# Altium schematic sheet adc.SchDoc: ADC_PCM1802_SCH
size A3; Author: Hojnadel - Salazar Ato; Revision: Rev1.0; SheetNumber: 5; SheetTotal: 6
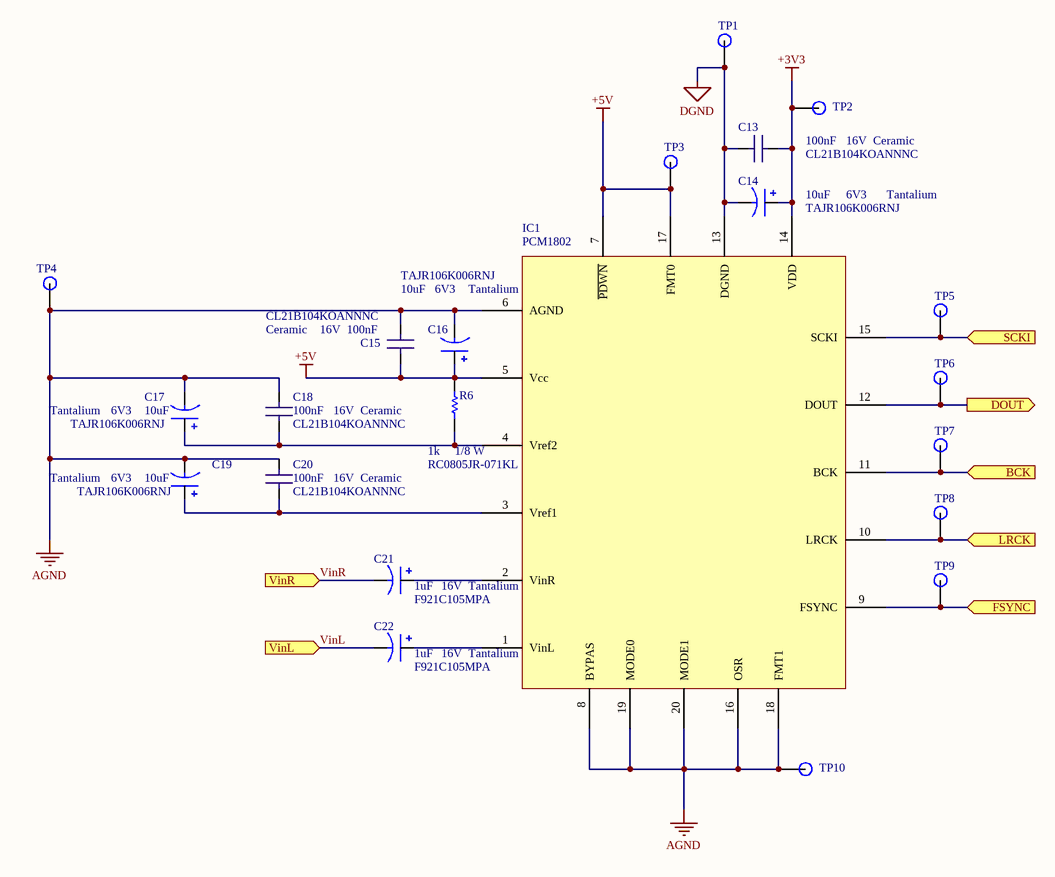
[diagram p0: adc.SchDoc]

## Parts
C13  C: 100nF  V: 16V  Part Number: CL21B104KOANNNC  Material: Ceramic  [C_0805]  (hidden comment: 100nF 16V Ceramic)
C14  C: 10uF  V: 6V3  Material: Tantalium  Part number: TAJR106K006RNJ  [C_0805_pol]  (hidden comment: 10uF 6V3 Tantalium)
C15  C: 100nF  V: 16V  Part Number: CL21B104KOANNNC  Material: Ceramic  [C_0805]  (hidden comment: 100nF 16V Ceramic)
C16  C: 10uF  V: 6V3  Material: Tantalium  Part number: TAJR106K006RNJ  [C_0805_pol]  (hidden comment: 10uF 6V3 Tantalium)
C17  C: 10uF  V: 6V3  Material: Tantalium  Part number: TAJR106K006RNJ  [C_0805_pol]  (hidden comment: 10uF 6V3 Tantalium)
C18  C: 100nF  V: 16V  Part Number: CL21B104KOANNNC  Material: Ceramic  [C_0805]  (hidden comment: 100nF 16V Ceramic)
C19  C: 10uF  V: 6V3  Material: Tantalium  Part number: TAJR106K006RNJ  [C_0805_pol]  (hidden comment: 10uF 6V3 Tantalium)
C20  C: 100nF  V: 16V  Part Number: CL21B104KOANNNC  Material: Ceramic  [C_0805]  (hidden comment: 100nF 16V Ceramic)
C21  C: 1uF  V: 16V  Material: Tantalium  Part number: F921C105MPA  [C_0805_pol]  (hidden comment: 1uF 16V Tantalium)
C22  C: 1uF  V: 16V  Material: Tantalium  Part number: F921C105MPA  [C_0805_pol]  (hidden comment: 1uF 16V Tantalium)
IC1  PCM1802  [SSOP_DB20]
R6  value 1k  Power: 1/8 W  Part Number: RC0805JR-071KL  [R_0805]  (hidden comment: 1k 1/8W)
TP1  TP  [TP]  (value not drawn)
TP2  TP  [TP]  (value not drawn)
TP3  TP  [TP]  (value not drawn)
TP4  TP  [TP]  (value not drawn)
TP5  TP  [TP]  (value not drawn)
TP6  TP  [TP]  (value not drawn)
TP7  TP  [TP]  (value not drawn)
TP8  TP  [TP]  (value not drawn)
TP9  TP  [TP]  (value not drawn)
TP10  TP  [TP]  (value not drawn)

## Ports
BCK (in), DOUT (out), FSYNC (in), LRCK (in), SCKI (in), VinL (in), VinR (in)

## Nets
+3V3: C13.2 C14.1 IC1.14(VDD) TP2.1
+5V: C15.2 C16.1 IC1.5(Vcc) IC1.7(~{PDWN}) IC1.17(FMT0) R6.1 TP3.1
AGND: C15.1 C16.2 C17.2 C18.1 C19.2 C20.1 IC1.6(AGND) IC1.8(BYPAS) IC1.16(OSR) IC1.18(FMT1) IC1.19(MODE0) IC1.20(MODE1) TP4.1 TP10.1
DGND: C13.1 C14.2 IC1.13(DGND) TP1.1
BCK: IC1.11(BCK) TP7.1 ; port BCK
DOUT: IC1.12(DOUT) TP6.1 ; port DOUT
FSYNC: IC1.9(FSYNC) TP9.1 ; port FSYNC
LRCK: IC1.10(LRCK) TP8.1 ; port LRCK
SCKI: IC1.15(SCKI) TP5.1 ; port SCKI
VinL: C22.2 ; port VinL
VinR: C21.2 ; port VinR
NetC17_1: C17.1 C18.2 IC1.4(Vref2) R6.2
NetC19_1: C19.1 C20.2 IC1.3(Vref1)
NetC21_1: C21.1 IC1.2(VinR)
NetC22_1: C22.1 IC1.1(VinL)

## Library data of the parts
C13 C15 C18 C20 = Cap1: Capacitor
C14 C16 C17 C19 C21 C22 = Cap_Elec: Capacitor
IC1 = PCM1802: Part Number: PCM1802DBR
R6 = Res1: Resistor
TP1-TP10 = Test Point